# Altium schematic sheet 19V_Supply_drawings.SchDoc
size A4
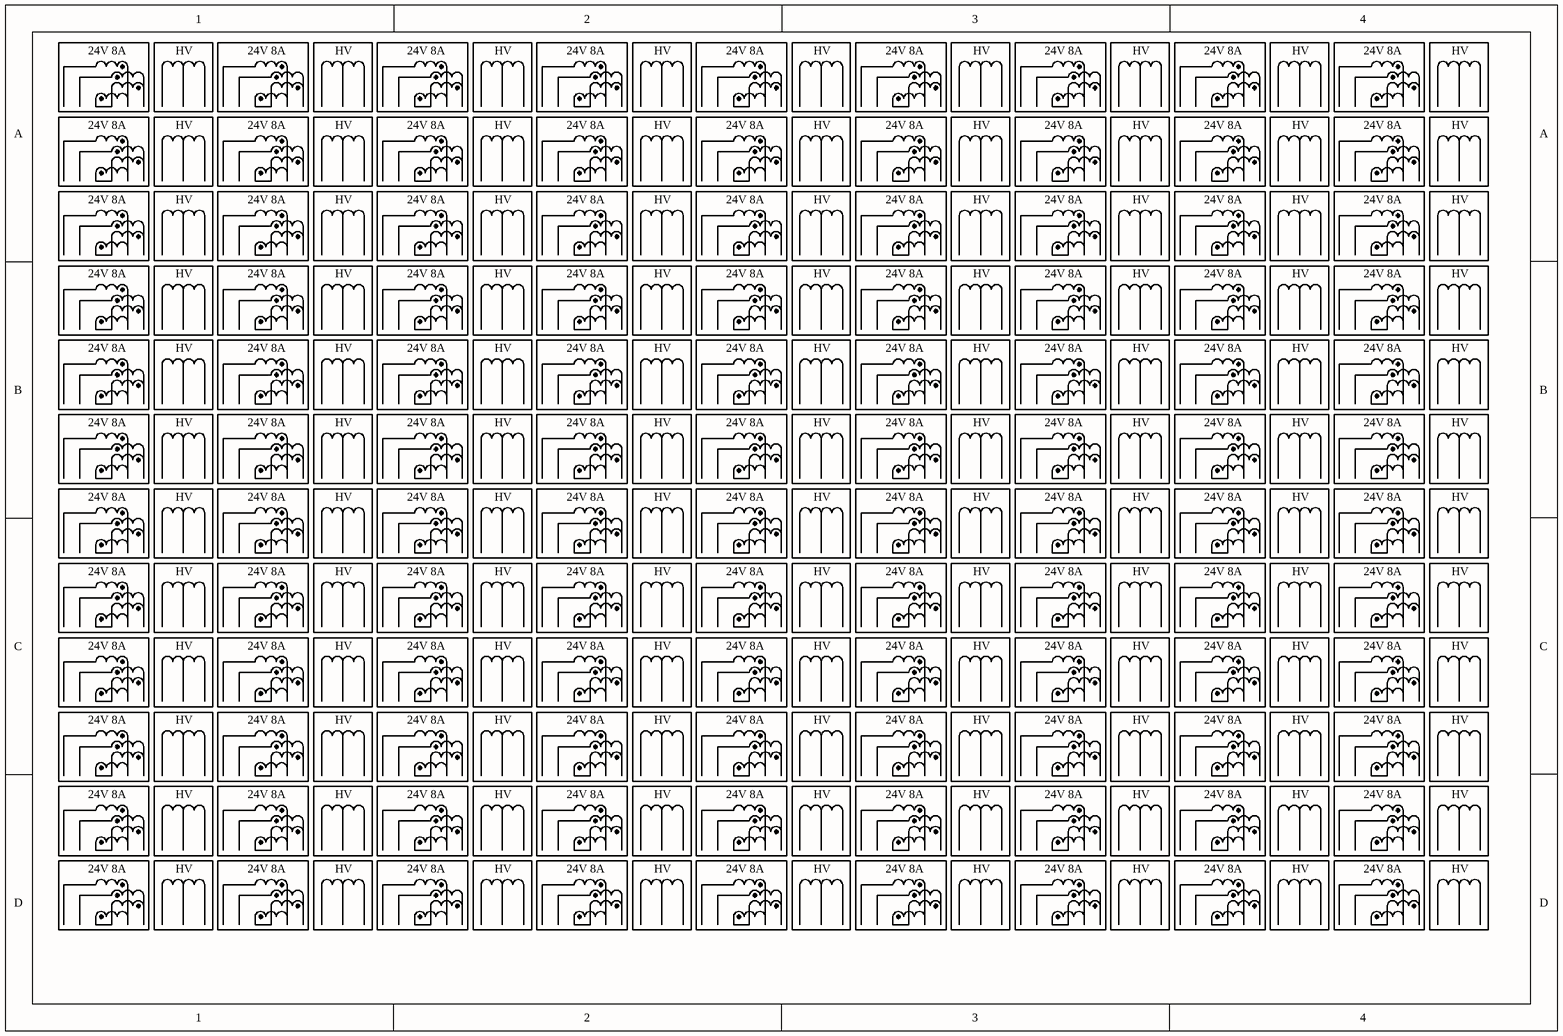
[diagram p0: 19V_Supply_drawings.SchDoc]

## Notes on the sheet
- 24V 8A
- HV